# EasyEDA Pro project Connective.eprj, schematic Schematic1
Create Date: 2023-12-03; Page Name: P1; Project Name: Connective; Schematic Name: Schematic1; Update Date: 2023-12-04; Company: 嘉立创EDA; Page Size: A3; Version: V1.0
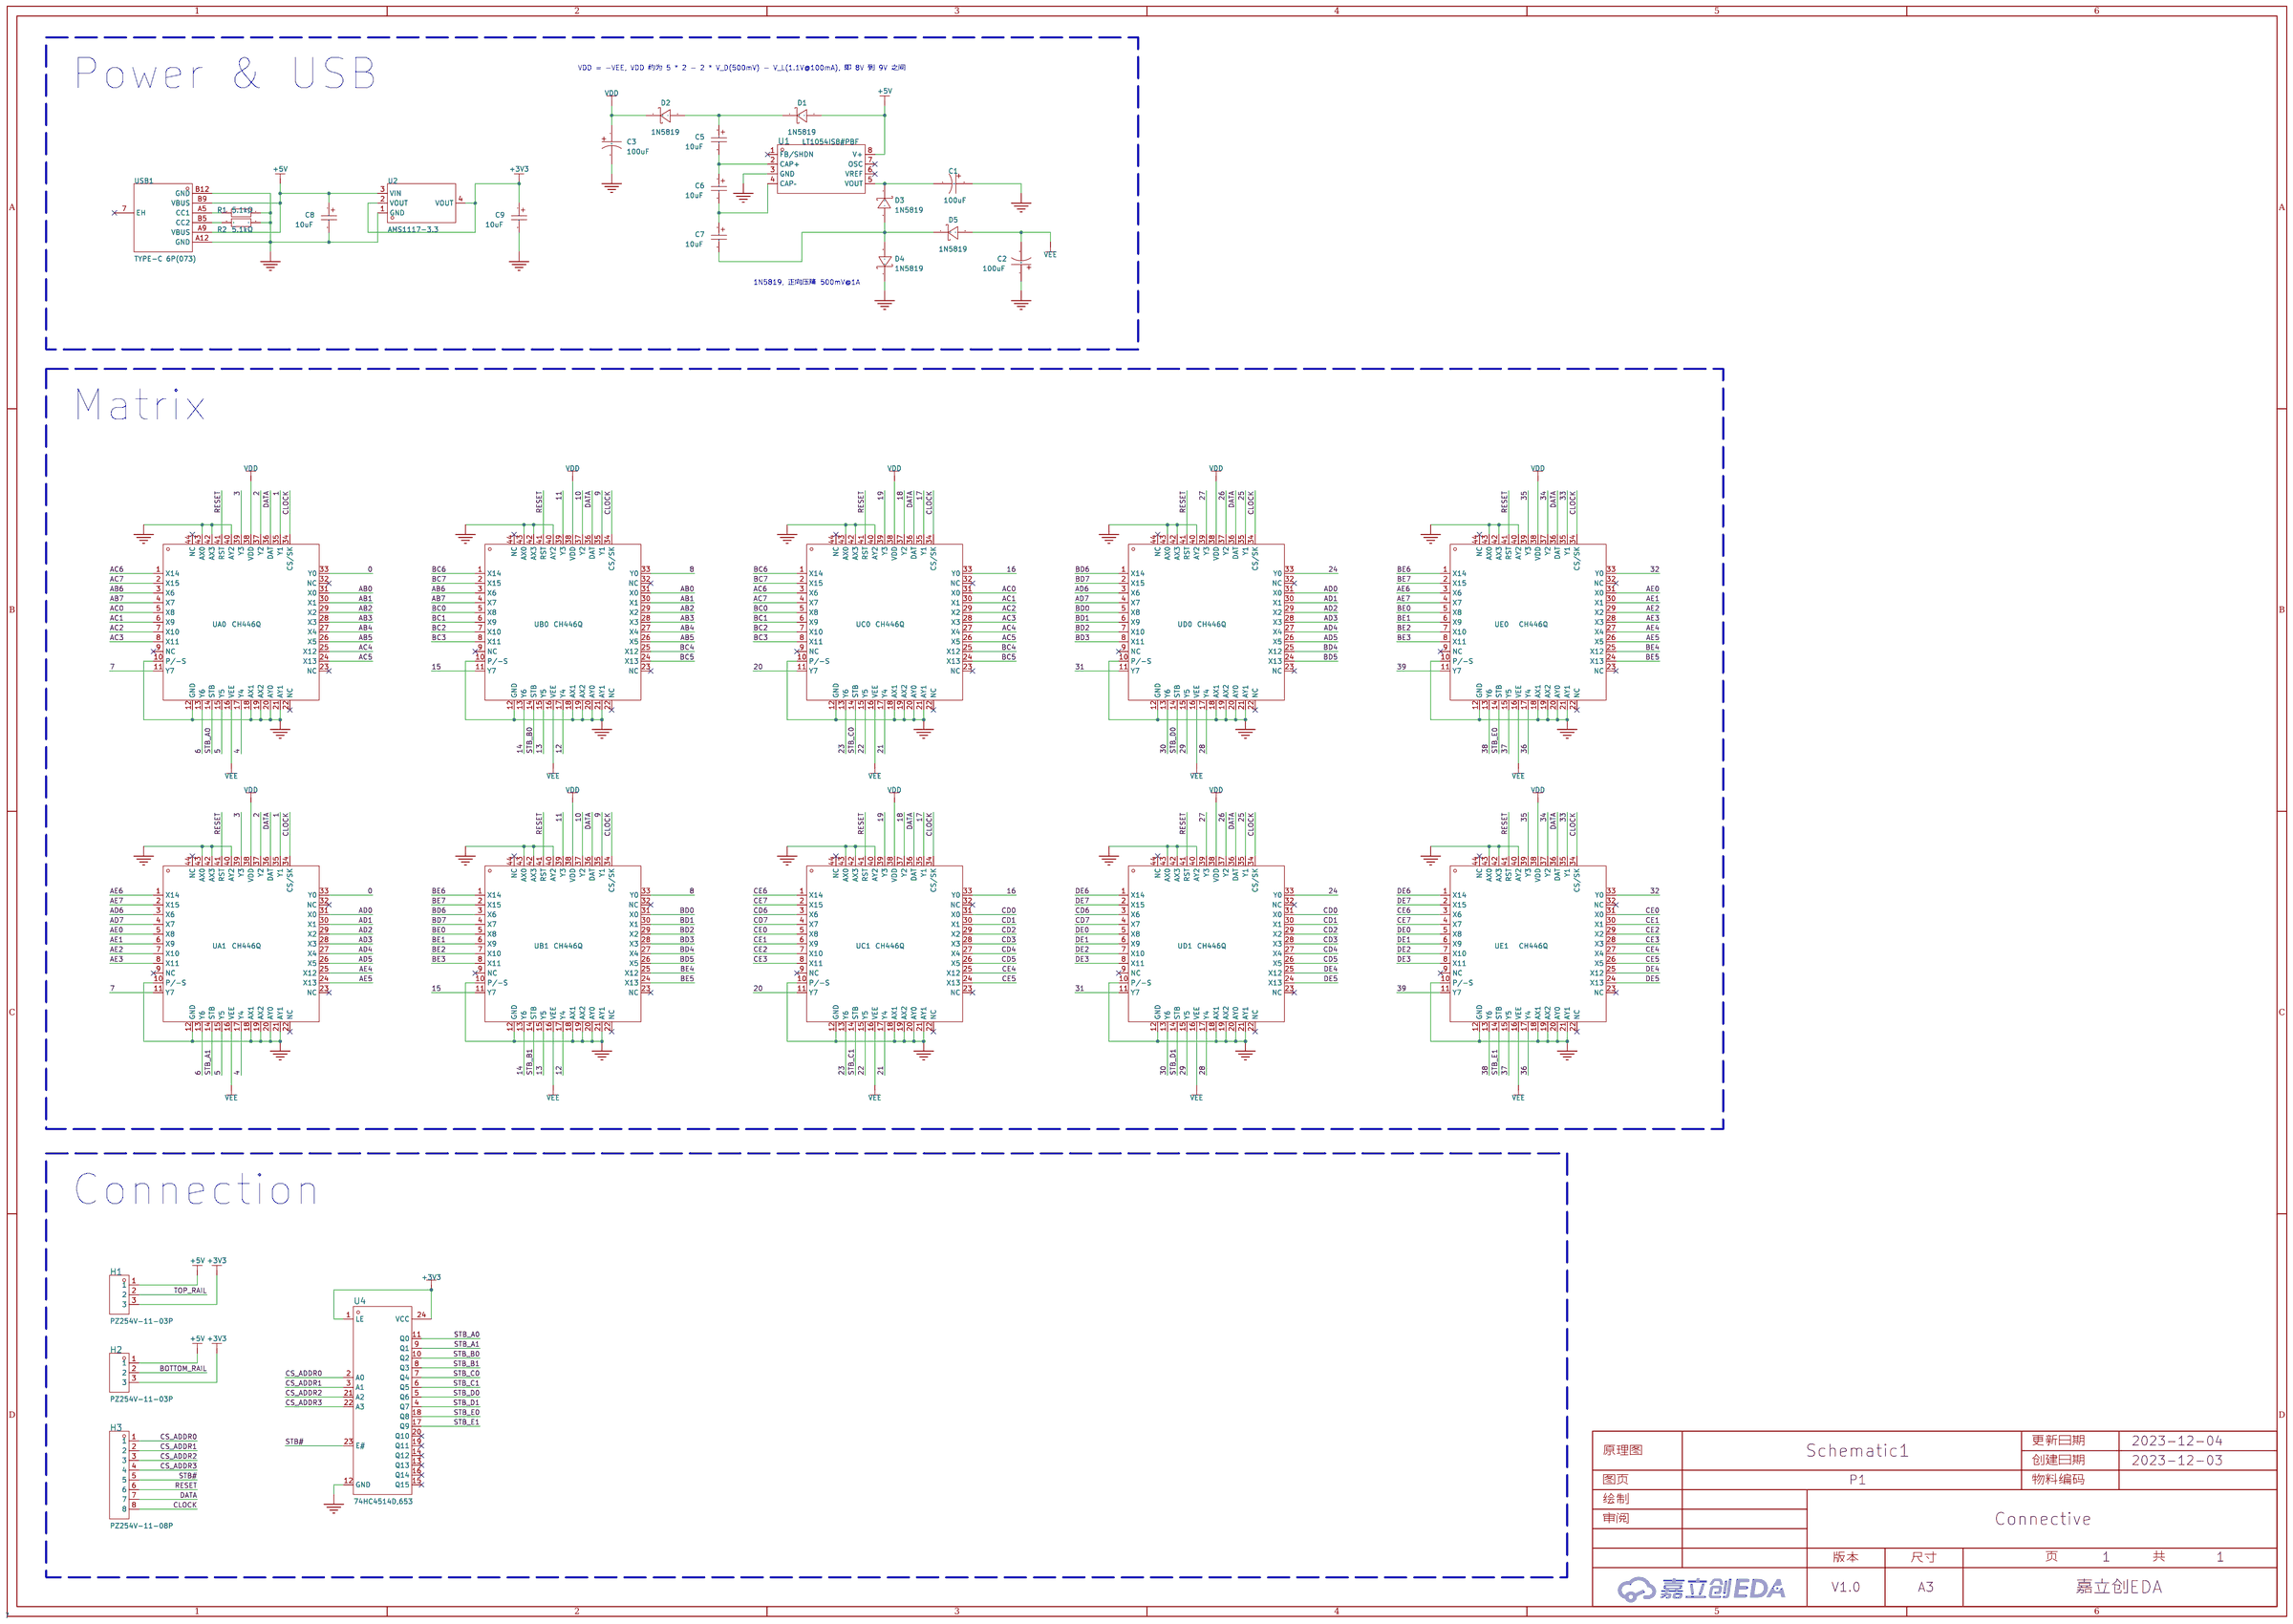
[diagram p0: schematic sheet]

## Parts
C1  100uF  [CAP-SMD_L3.5-W2.8]
C2  100uF  [CAP-SMD_L3.5-W2.8]
C3  100uF  [CAP-SMD_L3.5-W2.8]
C5  10uF  [CAP-SMD_L3.2-W1.6-RD]
C6  10uF  [CAP-SMD_L3.2-W1.6-RD]
C7  10uF  [CAP-SMD_L3.2-W1.6-RD]
C8  10uF  [CAP-SMD_L3.2-W1.6-RD]
C9  10uF  [CAP-SMD_L3.2-W1.6-RD]
D1  1N5819  [SMA_L4.4-W2.6-LS5.0-RD]
D2  1N5819  [SMA_L4.4-W2.6-LS5.0-RD]
D3  1N5819  [SMA_L4.4-W2.6-LS5.0-RD]
D4  1N5819  [SMA_L4.4-W2.6-LS5.0-RD]
D5  1N5819  [SMA_L4.4-W2.6-LS5.0-RD]
H1  PZ254V-11-03P  [HDR-TH_3P-P2.54-V-M]
H2  PZ254V-11-03P  [HDR-TH_3P-P2.54-V-M]
H3  PZ254V-11-08P  [HDR-TH_8P-P2.54-V-M]
R1  5.1kΩ  [R0603]
R2  5.1kΩ  [R0603]
U1  LT1054IS8#PBF  [SO-8_L4.9-W3.9-P1.27-LS6.0-BL]
U2  AMS1117-3.3  [SOT-223-3_L6.5-W3.4-P2.30-LS7.0-BR]
U4  74HC4514D,653  [SOIC-24_L15.4-W7.5-P1.27-LS10.3-BL]
UA0  CH446Q  [LQFP-44_L10.0-W10.0-P0.80-LS12.0-BL]
UA1  CH446Q  [LQFP-44_L10.0-W10.0-P0.80-LS12.0-BL]
UB0  CH446Q  [LQFP-44_L10.0-W10.0-P0.80-LS12.0-BL]
UB1  CH446Q  [LQFP-44_L10.0-W10.0-P0.80-LS12.0-BL]
UC0  CH446Q  [LQFP-44_L10.0-W10.0-P0.80-LS12.0-BL]
UC1  CH446Q  [LQFP-44_L10.0-W10.0-P0.80-LS12.0-BL]
UD0  CH446Q  [LQFP-44_L10.0-W10.0-P0.80-LS12.0-BL]
UD1  CH446Q  [LQFP-44_L10.0-W10.0-P0.80-LS12.0-BL]
UE0  CH446Q  [LQFP-44_L10.0-W10.0-P0.80-LS12.0-BL]
UE1  CH446Q  [LQFP-44_L10.0-W10.0-P0.80-LS12.0-BL]
USB1  TYPE-C 6P(073)  [TYPE-C-SMD_TYPE-C-6P]

## Library data of the parts
C1-C3 = CA45-107M010BT: 容值:100uF;精度:±20%;额定电压:10V;等效串联电阻:3Ω@100kHz;; LCSC Part Name: 100uF ±20% 10V; Supplier Part: C294207; Manufacturer: TANCAP(容电); Supplier Footprint: CASE-B-3528; JLCPCB Part Class: 扩展库; Datasheet: https://atta.szlcsc.com/upload/public/pdf/source/20180918/C294207_FBF1A61288119C22940C47A3470534C4.pdf; Supplier: LCSC; Tolerance: ±20%; Rated Voltage: 10V; Equivalent Series Resistance(ESR): 3Ω@100kHz; Operating Temperature: -55℃~+125℃
C5-C9 = CA45-A-16V-10uF-K: 容值:10uF;精度:±10%;额定电压:16V;等效串联电阻:10Ω@100kHz;; LCSC Part Name: 10uF ±10% 16V; Supplier Part: C128254; Manufacturer: CEC(振华新云); Supplier Footprint: CASE-A-3216; JLCPCB Part Class: 扩展库; Datasheet: https://atta.szlcsc.com/upload/public/pdf/source/20170914/C128254_1505359752472967905.pdf; Supplier: LCSC; Tolerance: ±10%; Rated Voltage: 16V; Equivalent Series Resistance(ESR): 10Ω@100kHz; Operating Temperature: -55℃~+125℃
D1-D5 = 1N5819_C437199: 直流反向耐压(Vr):40V;平均整流电流(Io):1A;正向压降(Vf):500mV@1A;; LCSC Part Name: 电压:40V 电流:1A; Supplier Part: C437199; Manufacturer: KEXIN(科信); Supplier Footprint: DO-214AC(SMA); JLCPCB Part Class: 扩展库; Datasheet: https://atta.szlcsc.com/upload/public/pdf/source/20191012/C437199_83583E622A6684E767605E43C169C596.pdf; Supplier: LCSC; Reverse Voltage (Vr): 40V; Average Rectified Current (Io): 1A; Forward Voltage (Vf@If): 500mV@1A
H1 H2 = PZ254V-11-03P: 排数:单排;总PIN位数:3;间距:2.54mm;插针结构:1x3P;行距:-;安装类型:直插;圆针/方针:方针;额定电流:3A;额定电压:250V;配合针长度:6mm;塑高:2.5mm;端接针长度:3mm;工作温度范围:-40℃~+105℃;颜色:黑色;; LCSC Part Name: 2.54mm 1x3P 直插 方针; Supplier Part: C2937625; Manufacturer: XFCN(兴飞); Supplier Footprint: 直插,P=2.54mm; JLCPCB Part Class: 扩展库; Datasheet: 2022-07-12/581362A/62b9d00620994b3696be7eb4af85ad72/双排排针和单排排针.pdf; Supplier: LCSC; Number of Rows: 单排; Number of Pins: 3; Pitch: 2.54mm; Pin Structure: 1x3P; Mounting Type: 直插; Circluar Pins/Square Pins: 方针; Current Rating (Max): 3A; Voltage Rating (Max): 250V; Length of Mating Pin: 6mm; Insulation Height: 2.5mm; Length of End Connection Pin: 3mm; Operating Temperature Range: -40℃~+105℃; Color: 黑色
H3 = PZ254V-11-08P: 排数:单排;总PIN位数:8P;间距:2.54mm;插针结构:1x8P;行距:-;安装类型:直插;圆针/方针:方针;额定电流:-;额定电压:-;配合针长度:6mm;塑高:2.5mm;端接针长度:3mm;触头材质:黄铜;触头镀层:-;工作温度范围:-40℃~+105℃;颜色:黑色;; LCSC Part Name: 2.54mm 1x8P 直插 方针; Supplier Part: C492407; Manufacturer: XFCN(兴飞); Supplier Footprint: 插件,P=2.54mm; JLCPCB Part Class: 扩展库; Datasheet: https://atta.szlcsc.com/upload/public/pdf/source/20200309/C492407_83A6FB26A2233368EDB9516968EC6149.pdf; Supplier: LCSC; Number of Rows: 单排; Number of Pins: 8P; Pitch: 2.54mm; Pin Structure: 1x8P; Mounting Type: 直插; Circluar Pins/Square Pins: 方针; Length of Mating Pin: 6mm; Insulation Height: 2.5mm; Length of End Connection Pin: 3mm; Contact Material: 黄铜; Operating Temperature Range: -40℃~+105℃; Color: 黑色
R1 R2 = 0603WAF5101T5E: 阻值:5.1kΩ;精度:±1%;功率:100mW;温度系数:±100ppm/℃;电阻类型:厚膜电阻;; LCSC Part Name: 5.1kΩ ±1% 100mW 厚膜电阻; Supplier Part: C23186; Manufacturer: UNI-ROYAL(厚声); Supplier Footprint: 0603; JLCPCB Part Class: 基础库; Datasheet: https://atta.szlcsc.com/upload/public/pdf/source/20200306/C422600_1E6D84923E4A46A82E41ADD87F860B5C.pdf; Supplier: LCSC; Tolerance: ±1%; Power(Watts): 100mW; Overload Voltage (Max): 75V; Temperature Coefficient: ±100ppm/℃; Type: 厚膜电阻; Operating Temperature Range: -55℃~+155℃
U1 = LT1054IS8#PBF: 功能类型:升压型;输出类型:可调和固定;输入电压:3.5V~15V;输出电压:2.5V~30V;输出电流(最大值):100mA;; LCSC Part Name: 升压型 输入3.5V~15V 输出2.5V~30V 100mA; Supplier Part: C579621; Manufacturer: ADI(亚德诺); Supplier Footprint: SO-8; JLCPCB Part Class: 扩展库; Datasheet: https://atta.szlcsc.com/upload/public/pdf/source/20200628/C662001_511F4733762767519A2227D5257A0B57.pdf; Supplier: LCSC; Function: 升压型; Synchronous Rectification: 否; Output Type: 可调和固定; Number of Outputs: 1; Input Voltage: 3.5V~15V; Output Voltage: 2.5V~30V; Output Current (Max): 100mA; Switching Frequency: 25kHz; Operating Temperature: -40℃~+100℃@(TJ)
U2 = AMS1117-3.3_C6186: 输出类型:固定;最大输入电压:-;输出电压:3.3V;输出电流:1A;电源纹波抑制比(PSRR):72dB@(120Hz);输出极性:正;; LCSC Part Name: 输出3.3V 1A; Supplier Part: C6186; Manufacturer: AMS; Supplier Footprint: SOT-223-3; JLCPCB Part Class: 基础库; Datasheet: https://atta.szlcsc.com/upload/public/pdf/source/20180727/C6186_7A095716F0823C02F1997A905E26C086.pdf; Supplier: LCSC; Output Type: 固定; Output Voltage: 3.3V; Output Current: 1A; Power Supply Rejection Ratio (PSRR): 72dB@(120Hz); Dropout Voltage: 1.3V@(800mA); Output Polarity: 正; Number of Outputs: 1
U4 = 74HC4514D,653: 灌电流(IOL):5.2mA;拉电流(IOH):5.2mA;供电电压:2V~6V;; Supplier Part: C5653; Manufacturer: Nexperia(安世); Supplier Footprint: SOP-24-300mil; JLCPCB Part Class: 扩展库; Datasheet: https://atta.szlcsc.com/upload/public/pdf/source/20190114/C58910_19F84CC38F4A02E6C23555158F34794E.pdf; Supplier: LCSC; Type: 解码器/多路分解器; Sink Current: 5.2mA; Source Current: 5.2mA; Voltage Supply Source: 单电源; Supply Voltage: 2V~6V; Operating temperature: -40℃~+125℃
UA0 UA1 UB0 UB1 UC0 UC1 UD0 UD1 UE0 UE1 = CH446Q: 开关电路:-;; Supplier Part: C109471; Manufacturer: WCH(南京沁恒); Supplier Footprint: LQFP-44(10x10); JLCPCB Part Class: 扩展库; Datasheet: https://atta.szlcsc.com/upload/public/pdf/source/20200903/C109471_F129A1A7215DA3A32D1255CA18FA9480.pdf; Supplier: LCSC
USB1 = TYPE-C 6P(073): 连接器类型:Type-C;标准:-;公母:母;触点数量:6P;端口数量:1;安装方式:卧贴;额定电流 - 电源:5A;工作温度范围:-25℃~+85℃;; LCSC Part Name: Type-C 母 卧贴; Supplier Part: C668623; Manufacturer: SHOU HAN(首韩); Supplier Footprint: SMD; JLCPCB Part Class: 扩展库; Datasheet: https://atta.szlcsc.com/upload/public/pdf/source/20200618/C668623_A4B260DED7AC1949BAC6AE39E9F4CD80.pdf; Supplier: LCSC; Connector Type: Type-C; Gender: 母; Number of Contacts: 6P; Number of Ports: 1; Mounting Style: 卧贴; Current Rating - Power (Max): 5A; Operating Temperature Range: -25℃~+85℃

## Nets
+3V3: C9.1 H1.3 H2.3 U2.2(VOUT) U2.4(VOUT) U4.1(LE) U4.24(VCC)
+5V: C8.1 D1.2(A) H1.1 H2.1 U1.8(V+) U2.3(VIN) USB1.A9(VBUS) USB1.B9(VBUS)
GND: C1.1 C2.1 C3.2 C8.2 C9.2 D4.1(C) R1.1 R2.1 U1.3(GND) U2.1(GND) U4.12(GND) UA0.10(P/-S) UA0.12(GND) UA0.18(AX1) UA0.19(AX2) UA0.20(AY0) UA0.21(AY1) UA0.40(AY2) UA0.42(AX3) UA0.43(AX0) UA1.10(P/-S) UA1.12(GND) UA1.18(AX1) UA1.19(AX2) UA1.20(AY0) UA1.21(AY1) UA1.40(AY2) UA1.42(AX3) UA1.43(AX0) UB0.10(P/-S) UB0.12(GND) UB0.18(AX1) UB0.19(AX2) UB0.20(AY0) UB0.21(AY1) UB0.40(AY2) UB0.42(AX3) UB0.43(AX0) UB1.10(P/-S) UB1.12(GND) UB1.18(AX1) UB1.19(AX2) UB1.20(AY0) UB1.21(AY1) UB1.40(AY2) UB1.42(AX3) UB1.43(AX0) UC0.10(P/-S) UC0.12(GND) UC0.18(AX1) UC0.19(AX2) UC0.20(AY0) UC0.21(AY1) UC0.40(AY2) UC0.42(AX3) UC0.43(AX0) UC1.10(P/-S) UC1.12(GND) UC1.18(AX1) UC1.19(AX2) UC1.20(AY0) UC1.21(AY1) UC1.40(AY2) UC1.42(AX3) UC1.43(AX0) UD0.10(P/-S) UD0.12(GND) UD0.18(AX1) UD0.19(AX2) UD0.20(AY0) UD0.21(AY1) UD0.40(AY2) UD0.42(AX3) UD0.43(AX0) UD1.10(P/-S) UD1.12(GND) UD1.18(AX1) UD1.19(AX2) UD1.20(AY0) UD1.21(AY1) UD1.40(AY2) UD1.42(AX3) UD1.43(AX0) UE0.10(P/-S) UE0.12(GND) UE0.18(AX1) UE0.19(AX2) UE0.20(AY0) UE0.21(AY1) UE0.40(AY2) UE0.42(AX3) UE0.43(AX0) UE1.10(P/-S) UE1.12(GND) UE1.18(AX1) UE1.19(AX2) UE1.20(AY0) UE1.21(AY1) UE1.40(AY2) UE1.42(AX3) UE1.43(AX0) USB1.A12(GND) USB1.B12(GND)
VDD: C3.1 D2.1(C) UA0.38(VDD) UA1.38(VDD) UB0.38(VDD) UB1.38(VDD) UC0.38(VDD) UC1.38(VDD) UD0.38(VDD) UD1.38(VDD) UE0.38(VDD) UE1.38(VDD)
VEE: C2.2 D5.2(A) UA0.16(VEE) UA1.16(VEE) UB0.16(VEE) UB1.16(VEE) UC0.16(VEE) UC1.16(VEE) UD0.16(VEE) UD1.16(VEE) UE0.16(VEE) UE1.16(VEE)
0: UA0.33(Y0) UA1.33(Y0)
1: UA0.35(Y1) UA1.35(Y1)
2: UA0.37(Y2) UA1.37(Y2)
3: UA0.39(Y3) UA1.39(Y3)
4: UA0.17(Y4) UA1.17(Y4)
5: UA0.15(Y5) UA1.15(Y5)
6: UA0.13(Y6) UA1.13(Y6)
7: UA0.11(Y7) UA1.11(Y7)
8: UB0.33(Y0) UB1.33(Y0)
9: UB0.35(Y1) UB1.35(Y1)
10: UB0.37(Y2) UB1.37(Y2)
11: UB0.39(Y3) UB1.39(Y3)
12: UB0.17(Y4) UB1.17(Y4)
13: UB0.15(Y5) UB1.15(Y5)
14: UB0.13(Y6) UB1.13(Y6)
15: UB0.11(Y7) UB1.11(Y7)
16: UC0.33(Y0) UC1.33(Y0)
17: UC0.35(Y1) UC1.35(Y1)
18: UC0.37(Y2) UC1.37(Y2)
19: UC0.39(Y3) UC1.39(Y3)
20: UC0.11(Y7) UC1.11(Y7)
21: UC0.17(Y4) UC1.17(Y4)
22: UC0.15(Y5) UC1.15(Y5)
23: UC0.13(Y6) UC1.13(Y6)
24: UD0.33(Y0) UD1.33(Y0)
25: UD0.35(Y1) UD1.35(Y1)
26: UD0.37(Y2) UD1.37(Y2)
27: UD0.39(Y3) UD1.39(Y3)
28: UD0.17(Y4) UD1.17(Y4)
29: UD0.15(Y5) UD1.15(Y5)
30: UD0.13(Y6) UD1.13(Y6)
31: UD0.11(Y7) UD1.11(Y7)
32: UE0.33(Y0) UE1.33(Y0)
33: UE0.35(Y1) UE1.35(Y1)
34: UE0.37(Y2) UE1.37(Y2)
35: UE0.39(Y3) UE1.39(Y3)
36: UE0.17(Y4) UE1.17(Y4)
37: UE0.15(Y5) UE1.15(Y5)
38: UE0.13(Y6) UE1.13(Y6)
39: UE0.11(Y7) UE1.11(Y7)
AB0: UA0.31(X0) UB0.31(X0)
AB1: UA0.30(X1) UB0.30(X1)
AB2: UA0.29(X2) UB0.29(X2)
AB3: UA0.28(X3) UB0.28(X3)
AB4: UA0.27(X4) UB0.27(X4)
AB5: UA0.26(X5) UB0.26(X5)
AB6: UA0.3(X6) UB0.3(X6)
AB7: UA0.4(X7) UB0.4(X7)
AC0: UA0.5(X8) UC0.31(X0)
AC1: UA0.6(X9) UC0.30(X1)
AC2: UA0.7(X10) UC0.29(X2)
AC3: UA0.8(X11) UC0.28(X3)
AC4: UA0.25(X12) UC0.27(X4)
AC5: UA0.24(X13) UC0.26(X5)
AC6: UA0.1(X14) UC0.3(X6)
AC7: UA0.2(X15) UC0.4(X7)
AD0: UA1.31(X0) UD0.31(X0)
AD1: UA1.30(X1) UD0.30(X1)
AD2: UA1.29(X2) UD0.29(X2)
AD3: UA1.28(X3) UD0.28(X3)
AD4: UA1.27(X4) UD0.27(X4)
AD5: UA1.26(X5) UD0.26(X5)
AD6: UA1.3(X6) UD0.3(X6)
AD7: UA1.4(X7) UD0.4(X7)
AE0: UA1.5(X8) UE0.31(X0)
AE1: UA1.6(X9) UE0.30(X1)
AE2: UA1.7(X10) UE0.29(X2)
AE3: UA1.8(X11) UE0.28(X3)
AE4: UA1.25(X12) UE0.27(X4)
AE5: UA1.24(X13) UE0.26(X5)
AE6: UA1.1(X14) UE0.3(X6)
AE7: UA1.2(X15) UE0.4(X7)
BC0: UB0.5(X8) UC0.5(X8)
BC1: UB0.6(X9) UC0.6(X9)
BC2: UB0.7(X10) UC0.7(X10)
BC3: UB0.8(X11) UC0.8(X11)
BC4: UB0.25(X12) UC0.25(X12)
BC5: UB0.24(X13) UC0.24(X13)
BC6: UB0.1(X14) UC0.1(X14)
BC7: UB0.2(X15) UC0.2(X15)
BD0: UB1.31(X0) UD0.5(X8)
BD1: UB1.30(X1) UD0.6(X9)
BD2: UB1.29(X2) UD0.7(X10)
BD3: UB1.28(X3) UD0.8(X11)
BD4: UB1.27(X4) UD0.25(X12)
BD5: UB1.26(X5) UD0.24(X13)
BD6: UB1.3(X6) UD0.1(X14)
BD7: UB1.4(X7) UD0.2(X15)
BE0: UB1.5(X8) UE0.5(X8)
BE1: UB1.6(X9) UE0.6(X9)
BE2: UB1.7(X10) UE0.7(X10)
BE3: UB1.8(X11) UE0.8(X11)
BE4: UB1.25(X12) UE0.25(X12)
BE5: UB1.24(X13) UE0.24(X13)
BE6: UB1.1(X14) UE0.1(X14)
BE7: UB1.2(X15) UE0.2(X15)
BOTTOM_RAIL: H2.2
CD0: UC1.31(X0) UD1.31(X0)
CD1: UC1.30(X1) UD1.30(X1)
CD2: UC1.29(X2) UD1.29(X2)
CD3: UC1.28(X3) UD1.28(X3)
CD4: UC1.27(X4) UD1.27(X4)
CD5: UC1.26(X5) UD1.26(X5)
CD6: UC1.3(X6) UD1.3(X6)
CD7: UC1.4(X7) UD1.4(X7)
CE0: UC1.5(X8) UE1.31(X0)
CE1: UC1.6(X9) UE1.30(X1)
CE2: UC1.7(X10) UE1.29(X2)
CE3: UC1.8(X11) UE1.28(X3)
CE4: UC1.25(X12) UE1.27(X4)
CE5: UC1.24(X13) UE1.26(X5)
CE6: UC1.1(X14) UE1.3(X6)
CE7: UC1.2(X15) UE1.4(X7)
CLOCK: H3.8 UA0.34(CS/SK) UA1.34(CS/SK) UB0.34(CS/SK) UB1.34(CS/SK) UC0.34(CS/SK) UC1.34(CS/SK) UD0.34(CS/SK) UD1.34(CS/SK) UE0.34(CS/SK) UE1.34(CS/SK)
CS_ADDR0: H3.1 U4.2(A0)
CS_ADDR1: H3.2 U4.3(A1)
CS_ADDR2: H3.3 U4.21(A2)
CS_ADDR3: H3.4 U4.22(A3)
DATA: H3.7 UA0.36(DAT) UA1.36(DAT) UB0.36(DAT) UB1.36(DAT) UC0.36(DAT) UC1.36(DAT) UD0.36(DAT) UD1.36(DAT) UE0.36(DAT) UE1.36(DAT)
DE0: UD1.5(X8) UE1.5(X8)
DE1: UD1.6(X9) UE1.6(X9)
DE2: UD1.7(X10) UE1.7(X10)
DE3: UD1.8(X11) UE1.8(X11)
DE4: UD1.25(X12) UE1.25(X12)
DE5: UD1.24(X13) UE1.24(X13)
DE6: UD1.1(X14) UE1.1(X14)
DE7: UD1.2(X15) UE1.2(X15)
RESET: H3.6 UA0.41(RST) UA1.41(RST) UB0.41(RST) UB1.41(RST) UC0.41(RST) UC1.41(RST) UD0.41(RST) UD1.41(RST) UE0.41(RST) UE1.41(RST)
STB#: H3.5 U4.23(E#)
STB_A0: U4.11(Q0) UA0.14(STB)
STB_A1: U4.9(Q1) UA1.14(STB)
STB_B0: U4.10(Q2) UB0.14(STB)
STB_B1: U4.8(Q3) UB1.14(STB)
STB_C0: U4.7(Q4) UC0.14(STB)
STB_C1: U4.6(Q5) UC1.14(STB)
STB_D0: U4.5(Q6) UD0.14(STB)
STB_D1: U4.4(Q7) UD1.14(STB)
STB_E0: U4.18(Q8) UE0.14(STB)
STB_E1: U4.17(Q9) UE1.14(STB)
TOP_RAIL: H1.2
$1N2223: C5.1 D1.1(C) D2.2(A)
$1N2564: C1.2 D3.1(C) U1.5(VOUT)
$1N2990: C5.2 C6.1 U1.2(CAP+)
$1N3088: C6.2 C7.1 U1.4(CAP–)
$1N3099: C7.2 D3.2(A) D4.2(A) D5.1(C)
$1N5240: R1.2 USB1.A5(CC1)
$1N5279: R2.2 USB1.B5(CC2)

Not connected (* = marked no-connect by the designer): U1 1(FB/SHDN)* 6(VREF)* 7(OSC)*; U4 13(Q13)* 14(Q12)* 15(Q15)* 16(Q14)* 19(Q11)* 20(Q10)*; UA0 9(NC)* 22(NC)* 23(NC)* 32(NC)* 44(NC)*; UA1 9(NC)* 22(NC)* 23(NC)* 32(NC)* 44(NC)*; UB0 9(NC)* 22(NC)* 23(NC)* 32(NC)* 44(NC)*; UB1 9(NC)* 22(NC)* 23(NC)* 32(NC)* 44(NC)*; UC0 9(NC)* 22(NC)* 23(NC)* 32(NC)* 44(NC)*; UC1 9(NC)* 22(NC)* 23(NC)* 32(NC)* 44(NC)*; UD0 9(NC)* 22(NC)* 23(NC)* 32(NC)* 44(NC)*; UD1 9(NC)* 22(NC)* 23(NC)* 32(NC)* 44(NC)*; UE0 9(NC)* 22(NC)* 23(NC)* 32(NC)* 44(NC)*; UE1 9(NC)* 22(NC)* 23(NC)* 32(NC)* 44(NC)*; USB1 7(EH)*

## Notes on the sheet
- Power & USB
- VDD = -VEE, VDD 约为 5 * 2 - 2 * V_D(500mV) - V_L(1.1V@100mA), 即 8V 到 9V 之间
- 1N5819, 正向压降 500mV@1A
- Matrix
- Connection
